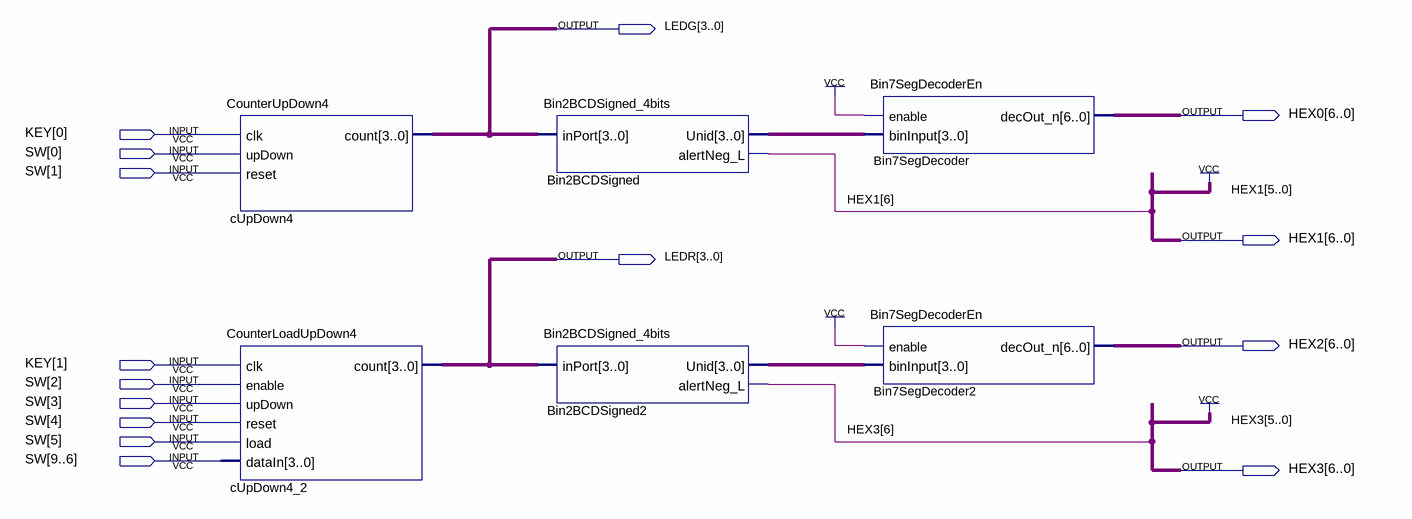
[diagram p0: schematic sheet]
// Quartus schematic Counter_Demo.bdf as structural Verilog: 6 symbols, 15 pins
module Counter_Demo (
  input  [1:0] KEY,
  input  [9:0] SW,
  output [3:0] LEDG,
  output [6:0] HEX0,
  output [6:0] HEX1,
  output [3:0] LEDR,
  output [6:0] HEX2,
  output [6:0] HEX3
);

  wire [3:0] Bin2BCDSigned2_unid, Bin2BCDSigned_unid;

  CounterUpDown4 cUpDown4 (.clk(KEY[0]), .upDown(SW[0]), .reset(SW[1]), .count(LEDG));
  CounterLoadUpDown4 cUpDown4_2 (
    .clk(KEY[1]), .enable(SW[2]), .upDown(SW[3]), .reset(SW[4]), .load(SW[5]), .dataIn(SW[9:6]), .count(LEDR));
  Bin2BCDSigned_4bits Bin2BCDSigned (.inPort(LEDG), .Unid(Bin2BCDSigned_unid), .alertNeg_L(HEX1[6]));
  Bin2BCDSigned_4bits Bin2BCDSigned2 (.inPort(LEDR), .Unid(Bin2BCDSigned2_unid), .alertNeg_L(HEX3[6]));
  Bin7SegDecoderEn Bin7SegDecoder (.enable(1'b1), .binInput(Bin2BCDSigned_unid), .decOut_n(HEX0));
  Bin7SegDecoderEn Bin7SegDecoder2 (.enable(1'b1), .binInput(Bin2BCDSigned2_unid), .decOut_n(HEX2));

  assign HEX1[5:0] = {6{1'b1}};
  assign HEX3[5:0] = {6{1'b1}};
endmodule
